# EAGLE design Isolated_Motor_Driver (EAGLE 7.2.0)
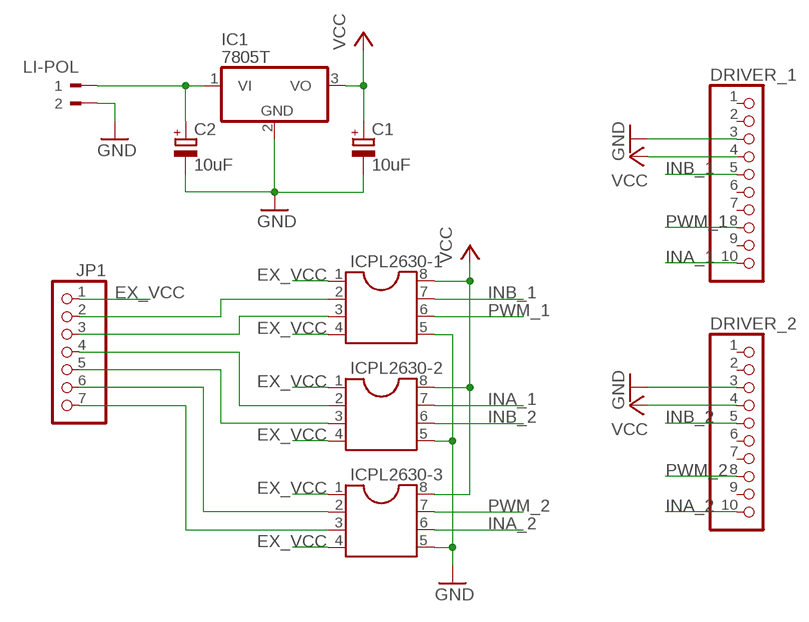
[diagram p0: schematic, sheet 1]

## Parts
C1  10uF  CPOL-EUE5-5  [E5-5]
C2  10uF  CPOL-EUE5-5  [E5-5]
DRIVER_1  PINHD-1X10  [1X10]
DRIVER_2  PINHD-1X10  [1X10]
IC1  7805T  [TO220H]
ICPL2630-1  DIL8S  [SOCKET-08]
ICPL2630-2  DIL8S  [SOCKET-08]
ICPL2630-3  DIL8S  [SOCKET-08]
JP1  PINHD-1X7  [1X07]
LI-POL  90-2  [90-2]

## Nets
EX_INA_1: ICPL2630-1.2 JP1.2
EX_INA_2: ICPL2630-2.3 JP1.5
EX_INB_1: ICPL2630-1.3 JP1.3
EX_INB_2: ICPL2630-3.2 JP1.6
EX_PWM_1: ICPL2630-2.2 JP1.4
EX_PWM_2: ICPL2630-3.3 JP1.7
EX_VCC: ICPL2630-1.1 ICPL2630-1.4 ICPL2630-2.1 ICPL2630-2.4 ICPL2630-3.1 ICPL2630-3.4 JP1.1
GND: C1.- C2.- DRIVER_1.3 DRIVER_2.3 IC1.2(GND) ICPL2630-1.5 ICPL2630-2.5 ICPL2630-3.5 LI-POL.2
INA_1: DRIVER_1.10 ICPL2630-2.7
INA_2: DRIVER_2.10 ICPL2630-3.6
INB_1: DRIVER_1.5 ICPL2630-1.7
INB_2: DRIVER_2.5 ICPL2630-2.6
N$1: C2.+ IC1.1(VI) LI-POL.1
PWM_1: DRIVER_1.8 ICPL2630-1.6
PWM_2: DRIVER_2.8 ICPL2630-3.7
VCC: C1.+ DRIVER_1.4 DRIVER_2.4 IC1.3(VO) ICPL2630-1.8 ICPL2630-2.8 ICPL2630-3.8
Unconnected: DRIVER_1.1 DRIVER_1.2 DRIVER_1.6 DRIVER_1.7 DRIVER_1.9 DRIVER_2.1 DRIVER_2.2 DRIVER_2.6 DRIVER_2.7 DRIVER_2.9

## Library data of the parts
C1 C2 = resistor:CPOL-EU: POLARIZED CAPACITOR, European symbol
DRIVER_1 DRIVER_2 = pinhead:PINHD-1X10: PIN HEADER
IC1 = linear:78*: Positive VOLTAGE REGULATOR Source: http://cache.national.com/ds/LM/LM78L05.pdf http://www.fairchildsemi.com/ds/LM/LM7805.pdf
ICPL2630-1-ICPL2630-3 = ic-package:DIL8: Dual In Line / Socket
JP1 = pinhead:PINHD-1X7: PIN HEADER
LI-POL = con-weidmueller-sl35:90-2: WEIDMUELLER CLAMP CONNECTOR; OC_FARNELL: unknown; OC_NEWARK: unknown

## Board
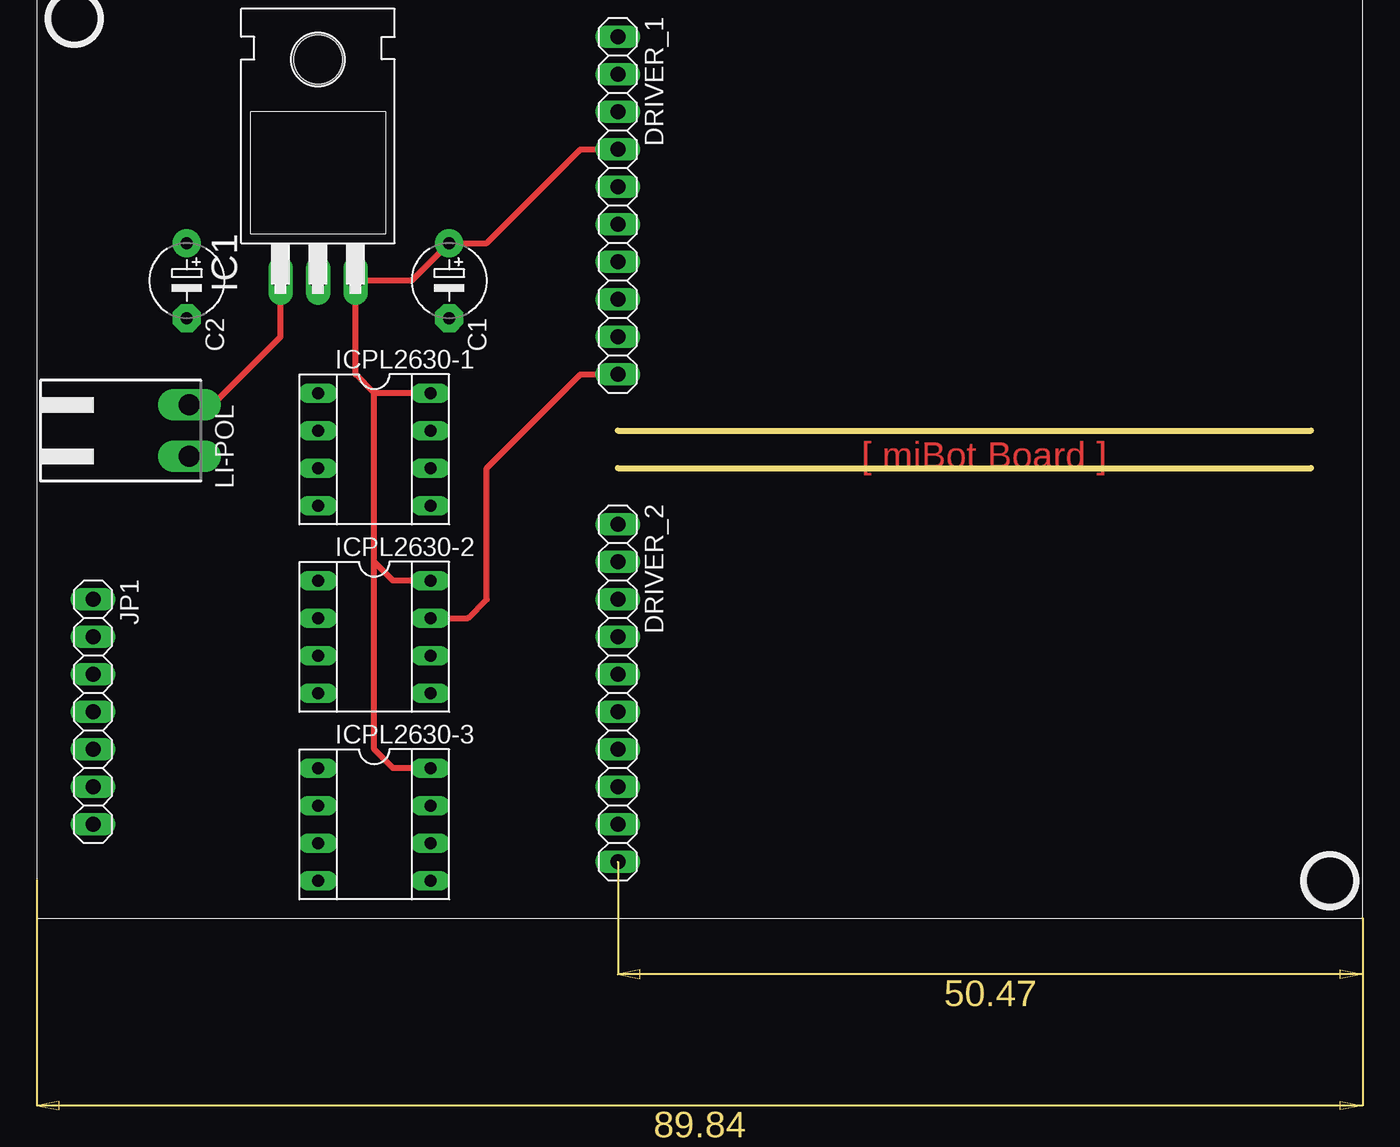
[diagram p1: board, top side]
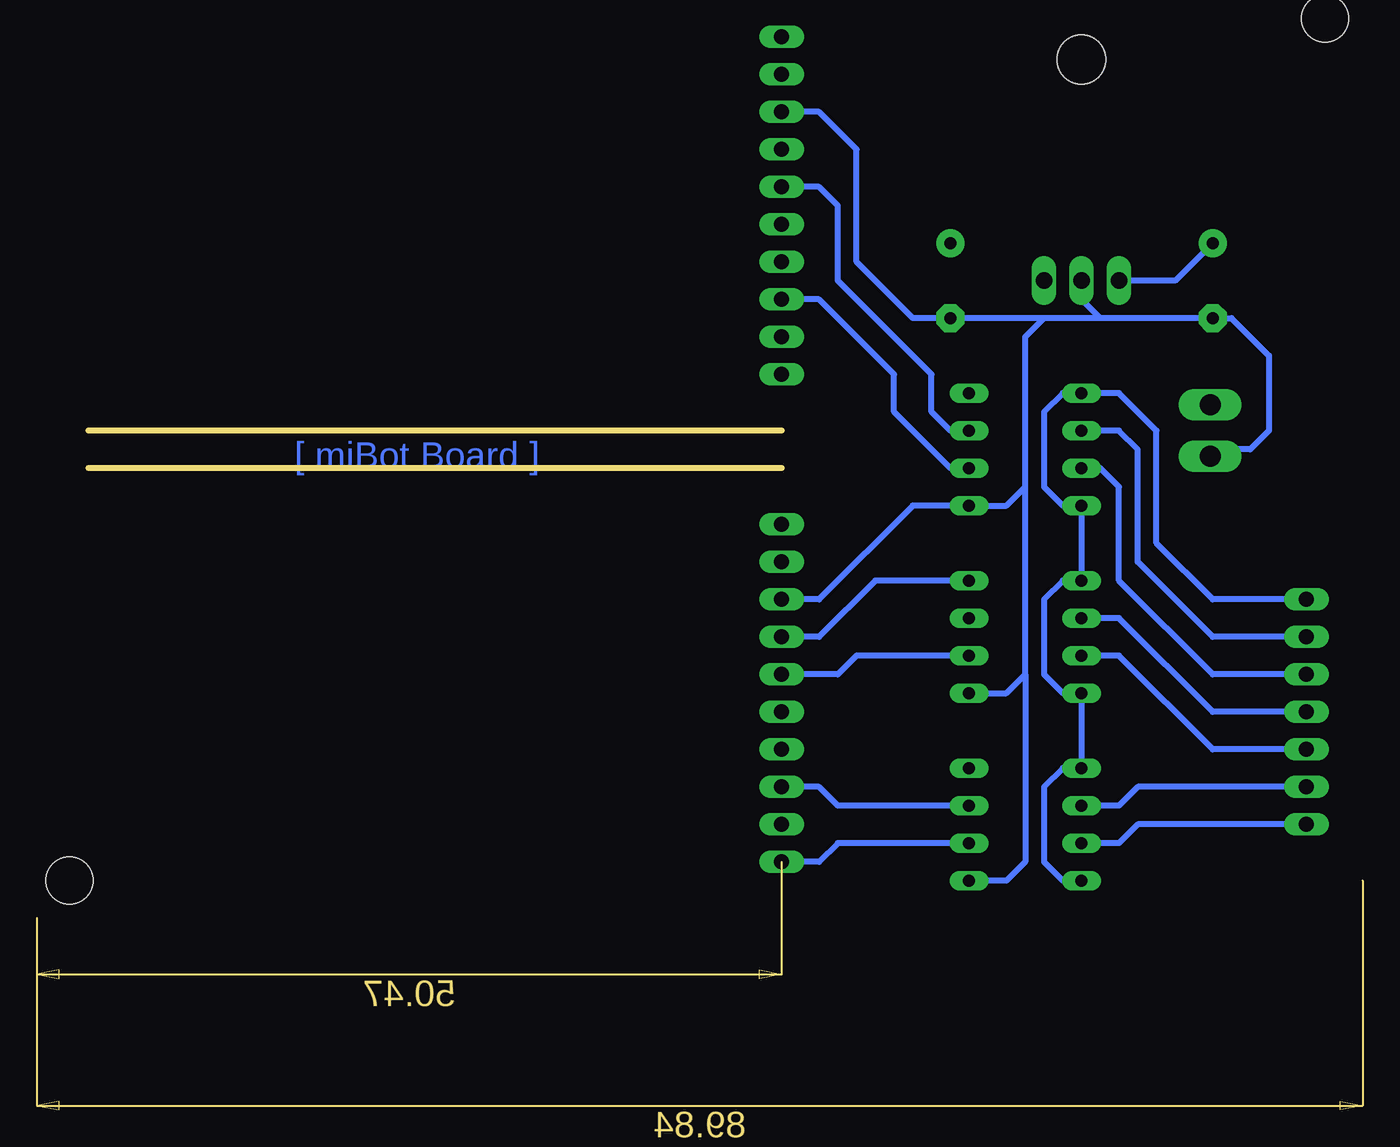
[diagram p2: board, bottom side, seen from below]

Size 46.99 x 2.54 mm. Coordinates in mm from the lower left corner, seen from the top.
Outline: 0,0 46.99,0
Outline: 0,2.54 46.99,2.54
Copper layers (1*16): Top 0.035mm / dielectric 1.5mm / Bottom 0.035mm
Design rules "default": minimum track width 10mil, minimum drill 24mil, track to track 8mil, track to pad 8mil, pad to pad 8mil, via to via 8mil, smd to smd 8mil, copper to edge 40mil, drill to drill 8mil, minimum pad ring 10mil, minimum via ring 8mil, stop-mask expansion 4mil, vias tented up to drill 0mil, thermal gap 10mil
Holes 3.2 mm at -36.83,30.48 48.26,-27.94

### Footprints (pad centres in the part's own frame; a part is rotated, then mirrored left to right if it is on the bottom)
E5-5 = drill 0.813 pad 1.905: + -2.54,0 | drill 0.813 pad 1.905 octagon: - 2.54,0
1X10 = drill 1.016 long: 1 -11.43,0; 2 -8.89,0; 3 -6.35,0; 4 -3.81,0; 5 -1.27,0; 6 1.27,0; 7 3.81,0; 8 6.35,0; 9 8.89,0; 10 11.43,0
TO220H = drill 1.118 long: 1 -2.54,-10.16; 2 0,-10.16; 3 2.54,-10.16 | hole 3.302: 0,4.826
SOCKET-08 = drill 0.813 long: 1 -3.81,-3.81; 2 -1.27,-3.81; 3 1.27,-3.81; 4 3.81,-3.81; 5 3.81,3.81; 6 1.27,3.81; 7 -1.27,3.81; 8 -3.81,3.81
1X07 = drill 1.016 long: 1 -7.62,0; 2 -5.08,0; 3 -2.54,0; 4 0,0; 5 2.54,0; 6 5.08,0; 7 7.62,0
90-2 = drill 1.422 long: 1 -1.75,5.25; 2 1.75,5.25

### Placement (x,y rotation side)
C1  -11.43,12.7 270 top  (outside the outline)
C2  -29.21,12.7 270 top  (outside the outline)
DRIVER_1  0,17.78 270 top  (outside the outline)
DRIVER_2  0,-15.24 270 top  (outside the outline)
IC1  -20.32,22.86 0 top  (outside the outline)
ICPL2630-1  -16.51,1.27 270 top  (outside the outline)
ICPL2630-2  -16.51,-11.43 270 top  (outside the outline)
ICPL2630-3  -16.51,-24.13 270 top  (outside the outline)
JP1  -35.56,-16.51 270 top  (outside the outline)
LI-POL  -34.29,2.54 270 top  (outside the outline)

### Tracks (layer width: path | path; a pad name or v marks a point on that pad's centre or on a via)
EX_INA_1
  Bottom 0.406: JP1.2 -29.21,-11.43 -24.13,-6.35 -24.13,1.27 -22.86,2.54 ICPL2630-1.2
EX_INA_2
  Bottom 0.406: JP1.5 -29.21,-19.05 -22.86,-12.7 ICPL2630-2.3
EX_INB_1
  Bottom 0.406: JP1.3 -29.21,-13.97 -22.86,-7.62 -22.86,-1.27 -21.59,0 ICPL2630-1.3
EX_INB_2
  Bottom 0.406: JP1.6 -24.13,-21.59 -22.86,-22.86 ICPL2630-3.2
EX_PWM_1
  Bottom 0.406: JP1.4 -29.21,-16.51 -22.86,-10.16 ICPL2630-2.2
EX_PWM_2
  Bottom 0.406: JP1.7 -24.13,-24.13 -22.86,-25.4 ICPL2630-3.3
EX_VCC
  Bottom 0.406: ICPL2630-3.4 -19.05,-27.94 -17.78,-26.67 -17.78,-21.59 -19.05,-20.32 ICPL2630-3.1 ICPL2630-2.4 -19.05,-15.24 -17.78,-13.97 -17.78,-8.89 -19.05,-7.62 ICPL2630-2.1 ICPL2630-1.4 -19.05,-2.54 -17.78,-1.27 -17.78,3.81 -19.05,5.08 ICPL2630-1.1 -22.86,5.08 -25.4,2.54 -25.4,-5.08 -29.21,-8.89 JP1.1
GND
  Bottom 0.406: -21.59,10.16 C2.- -30.48,10.16 -33.02,7.62 -33.02,2.54 -31.75,1.27 -29.52,1.27 LI-POL.2 | IC1.2 -20.32,11.43 -21.59,10.16 | -21.59,10.16 -17.78,10.16 | -17.78,10.16 C1.- -8.89,10.16 -5.08,13.97 -5.08,21.59 -2.54,24.13 DRIVER_1.3 | -16.51,-1.27 -16.51,8.89 -17.78,10.16 | -16.51,-1.27 -15.24,-2.54 ICPL2630-1.5 -8.89,-2.54 -2.54,-8.89 DRIVER_2.3 | ICPL2630-2.5 -15.24,-15.24 -16.51,-13.97 | -16.51,-13.97 -16.51,-26.67 -15.24,-27.94 ICPL2630-3.5 | -16.51,-13.97 -16.51,-1.27
INA_1
  Top 0.406: ICPL2630-2.7 -10.16,-10.16 -8.89,-8.89 -8.89,0 -2.54,6.35 DRIVER_1.10
INA_2
  Bottom 0.406: ICPL2630-3.6 -3.81,-25.4 -2.54,-26.67 DRIVER_2.10
INB_1
  Bottom 0.406: ICPL2630-1.7 -11.43,2.54 -10.16,3.81 -10.16,6.35 -3.81,12.7 -3.81,17.78 -2.54,19.05 DRIVER_1.5
INB_2
  Bottom 0.406: ICPL2630-2.6 -5.08,-12.7 -3.81,-13.97 DRIVER_2.5
N$1
  Top 0.406: LI-POL.1 -27.46,4.29 -22.86,8.89 IC1.1
  Bottom 0.406: C2.+ -26.67,12.7 IC1.1
PWM_1
  Bottom 0.406: ICPL2630-1.6 -11.43,0 -7.62,3.81 -7.62,6.35 -2.54,11.43 DRIVER_1.8
PWM_2
  Bottom 0.406: ICPL2630-3.7 -3.81,-22.86 -2.54,-21.59 DRIVER_2.8
VCC
  Top 0.406: ICPL2630-1.8 -16.51,5.08 | -16.51,5.08 -17.78,6.35 IC1.3 -13.97,12.7 C1.+ -8.89,15.24 -2.54,21.59 DRIVER_1.4 | ICPL2630-2.8 -15.24,-7.62 -16.51,-6.35 | -16.51,-6.35 -16.51,5.08 | ICPL2630-3.8 -15.24,-20.32 -16.51,-19.05 -16.51,-6.35
  Bottom 0.406: ICPL2630-2.8 -6.35,-7.62 -2.54,-11.43 DRIVER_2.4

### Text on the board
Top: [ miBot Board ]
Bottom: [ miBot Board ]